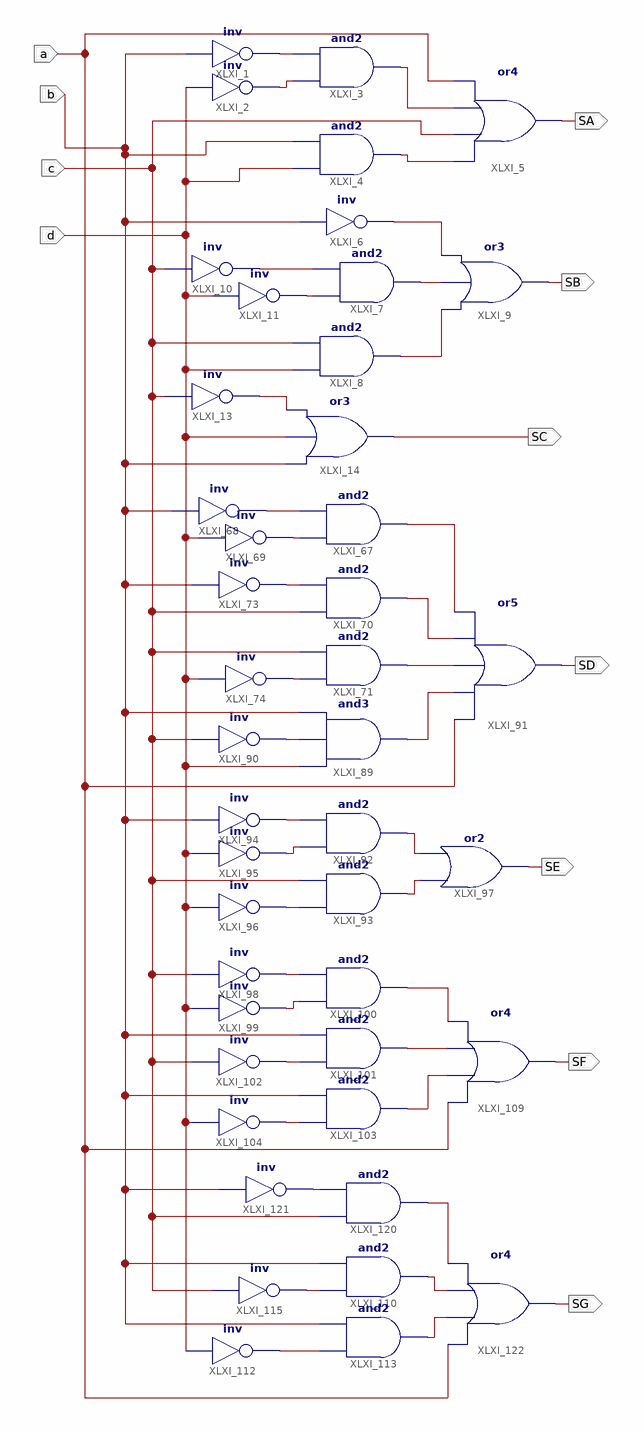
[diagram p0: schematic sheet 1]
// Xilinx ISE schematic segment.sch (spartan6) as structural Verilog: 44 symbols, 11 ports
module segment (
  input  b,
  input  c,
  input  d,
  input  a,
  output SB,
  output SC,
  output SD,
  output SE,
  output SF,
  output SG,
  output SA
);

  wire XLXN_1, XLXN_2, XLXN_8, XLXN_12, XLXN_13, XLXN_14, XLXN_16, XLXN_18, XLXN_26, XLXN_90, XLXN_91,
       XLXN_92, XLXN_93, XLXN_101, XLXN_102, XLXN_103, XLXN_104, XLXN_105, XLXN_108, XLXN_109, XLXN_110,
       XLXN_111, XLXN_112, XLXN_115, XLXN_116, XLXN_117, XLXN_118, XLXN_121, XLXN_122, XLXN_123, XLXN_127,
       XLXN_129, XLXN_133, XLXN_137, XLXN_138, XLXN_139, XLXN_181;

  not XLXI_1 (XLXN_1, b);
  not XLXI_2 (XLXN_2, d);
  and XLXI_3 (XLXN_8, XLXN_2, XLXN_1);
  not XLXI_6 (XLXN_12, b);
  and XLXI_8 (XLXN_14, d, c);
  or XLXI_9 (SB, XLXN_14, XLXN_13, XLXN_12);
  and XLXI_7 (XLXN_13, XLXN_16, XLXN_18);
  not XLXI_11 (XLXN_16, d);
  not XLXI_10 (XLXN_18, c);
  not XLXI_13 (XLXN_26, c);
  or XLXI_14 (SC, b, d, XLXN_26);
  and XLXI_67 (XLXN_102, XLXN_91, XLXN_90);
  not XLXI_68 (XLXN_90, b);
  not XLXI_69 (XLXN_91, d);
  and XLXI_70 (XLXN_103, c, XLXN_92);
  not XLXI_73 (XLXN_92, b);
  not XLXI_74 (XLXN_93, d);
  and XLXI_89 (XLXN_105, d, XLXN_101, b);
  not XLXI_90 (XLXN_101, c);
  or XLXI_91 (SD, a, XLXN_105, XLXN_104, XLXN_103, XLXN_102);
  and XLXI_92 (XLXN_110, XLXN_112, XLXN_108);
  and XLXI_93 (XLXN_111, XLXN_109, c);
  not XLXI_94 (XLXN_108, b);
  not XLXI_95 (XLXN_112, d);
  not XLXI_96 (XLXN_109, d);
  or XLXI_97 (SE, XLXN_111, XLXN_110);
  not XLXI_98 (XLXN_115, c);
  not XLXI_99 (XLXN_116, d);
  and XLXI_100 (XLXN_121, XLXN_116, XLXN_115);
  and XLXI_101 (XLXN_122, XLXN_117, b);
  not XLXI_102 (XLXN_117, c);
  and XLXI_103 (XLXN_123, XLXN_118, b);
  not XLXI_104 (XLXN_118, d);
  or XLXI_109 (SF, a, XLXN_123, XLXN_122, XLXN_121);
  not XLXI_112 (XLXN_127, d);
  and XLXI_113 (XLXN_139, XLXN_127, b);
  and XLXI_110 (XLXN_138, XLXN_129, b);
  not XLXI_115 (XLXN_129, c);
  and XLXI_120 (XLXN_137, c, XLXN_133);
  not XLXI_121 (XLXN_133, b);
  or XLXI_122 (SG, a, XLXN_139, XLXN_138, XLXN_137);
  and XLXI_71 (XLXN_104, XLXN_93, c);
  and XLXI_4 (XLXN_181, d, b);
  or XLXI_5 (SA, XLXN_181, c, XLXN_8, a);
endmodule
